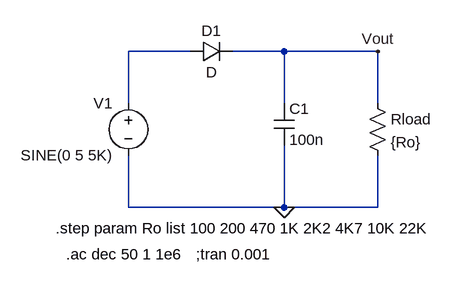
[diagram p0: schematic Apartado_B.asc]
Apartado_B.asc, the LTspice schematic file:
Version 4
SHEET 1 880 680
WIRE 144 48 48 48
WIRE 288 48 208 48
WIRE 432 48 288 48
WIRE 48 128 48 48
WIRE 288 128 288 48
WIRE 432 128 432 48
WIRE 48 288 48 208
WIRE 288 288 288 192
WIRE 288 288 48 288
WIRE 432 288 432 208
WIRE 432 288 288 288
FLAG 432 48 Vout
FLAG 288 288 0
SYMBOL voltage 48 112 M0
WINDOW 39 0 0 Left 2
SYMATTR InstName V1
SYMATTR Value SINE(0 5 5K)
SYMATTR Value2 AC 5
SYMBOL diode 144 64 R270
WINDOW 0 32 32 VTop 2
WINDOW 3 0 32 VBottom 2
SYMATTR InstName D1
SYMBOL cap 272 128 R0
SYMATTR InstName C1
SYMATTR Value 100n
SYMBOL res 416 112 R0
SYMATTR InstName Rload
SYMATTR Value {Ro}
TEXT -64 320 Left 2 !.step param Ro list 100 200 470 1K 2K2 4K7 10K 22K
TEXT 152 360 Left 2 !;tran 0.001
TEXT -48 360 Left 2 !.ac dec 50 1 1e6

The netlist it stands for:
* Apartado_B.asc
V1 N001 0 SINE(0 5 5K) AC 5
D1 N001 Vout D
C1 Vout 0 100n
Rload Vout 0 {Ro}
.model D D
.lib standard.dio
.step param Ro list 100 200 470 1K 2K2 4K7 10K 22K
;tran 0.001
.ac dec 50 1 1e6
.backanno
.end

* Results of the author's LTspice run, read from the files saved beside the schematic
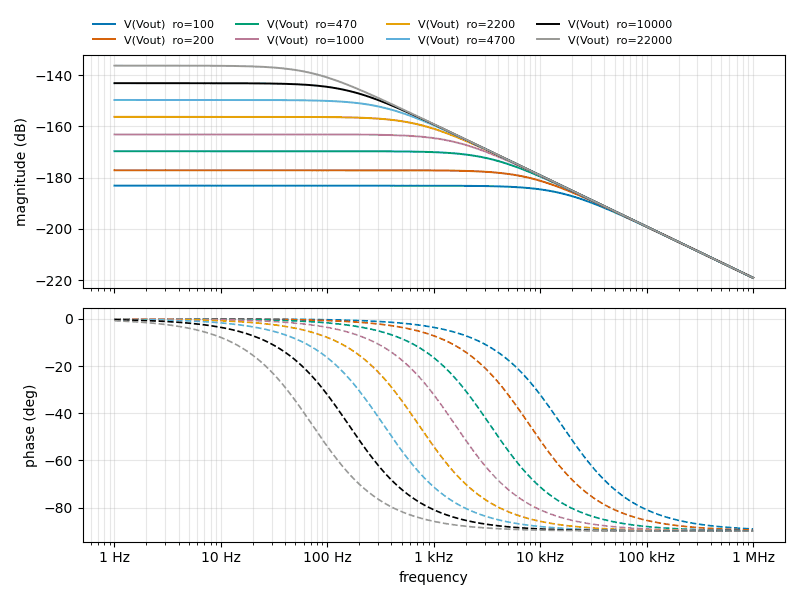
[diagram p1: AC Analysis of Apartado_B.asc, plotted from the saved traces]
* AC Analysis, 8 runs:
*   V(Vout) [ro=100]: -183.18 dB at 1 Hz, -219.15 dB at 1 MHz, peak -183.18 dB at 1 Hz, 3 dB below the peak at 15.91 kHz
*   V(Vout) [ro=200]: -177.16 dB at 1 Hz, -219.15 dB at 1 MHz, peak -177.16 dB at 1 Hz, 3 dB below the peak at 7.957 kHz
*   V(Vout) [ro=470]: -169.74 dB at 1 Hz, -219.15 dB at 1 MHz, peak -169.74 dB at 1 Hz, 3 dB below the peak at 3.385 kHz
*   V(Vout) [ro=1000]: -163.18 dB at 1 Hz, -219.15 dB at 1 MHz, peak -163.18 dB at 1 Hz, 3 dB below the peak at 1.591 kHz
*   V(Vout) [ro=2200]: -156.33 dB at 1 Hz, -219.15 dB at 1 MHz, peak -156.33 dB at 1 Hz, 3 dB below the peak at 723.4 Hz
*   V(Vout) [ro=4700]: -149.74 dB at 1 Hz, -219.15 dB at 1 MHz, peak -149.74 dB at 1 Hz, 3 dB below the peak at 338.5 Hz
*   V(Vout) [ro=10000]: -143.18 dB at 1 Hz, -219.15 dB at 1 MHz, peak -143.18 dB at 1 Hz, 3 dB below the peak at 159.1 Hz
*   V(Vout) [ro=22000]: -136.33 dB at 1 Hz, -219.15 dB at 1 MHz, peak -136.33 dB at 1 Hz, 3 dB below the peak at 72.35 Hz